# EAGLE design MXRDist+1590a (EAGLE 6.5.0)
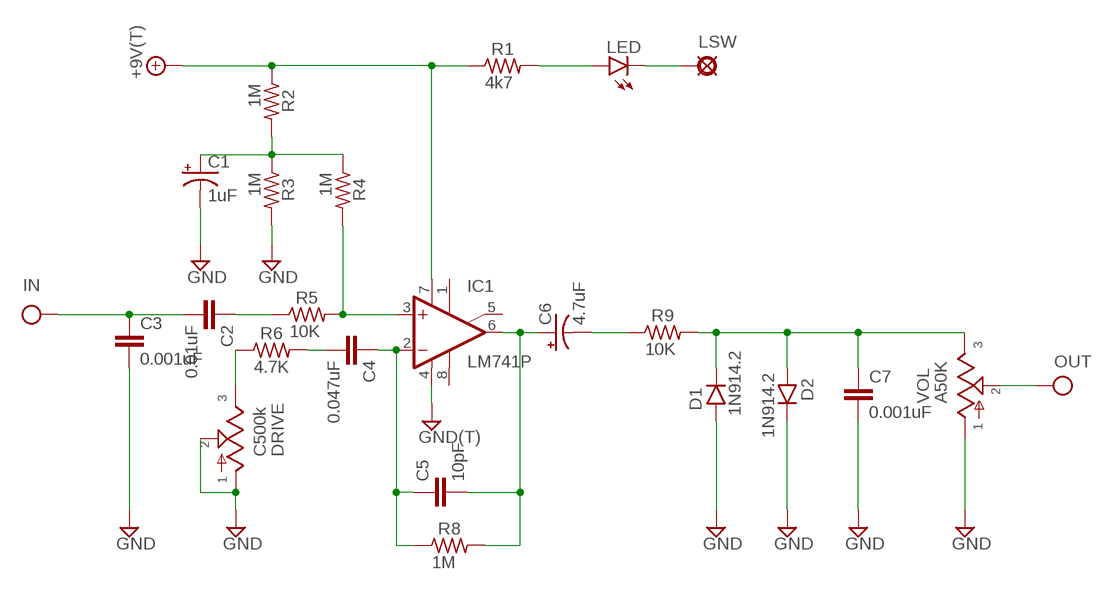
[diagram p0: schematic, sheet 1]

## Parts
+9V  +9V(T)  [SQUARE]
C1  1uF  044A1  [044A]
C2  0.01uF  070X0302  [070X030]
C3  0.001uF  070X0302  [070X030]
C4  0.047uF  070X0302  [070X030]
C5  10pF  050X030_0501  [050X030_050_1]
C6  4.7uF  044A1  [044A]
C7  0.001uF  070X0302  [070X030]
D1  1N914.2  [DO35-2]
D2  1N914.2  [DO35-2]
DRIVE  C500k  9MM  [POT_9MM_PACK]
GND  GND(T)  [SQUARE]
IC1  LM741P  [DIL08]
IN  IN(T)  [SQUARE]
LED  LED3MM  [LED3MM]
LSW  PAD  [SQUARE]
OUT  OUT(T)  [SQUARE]
R1  4k7  6MM.1  [R0207/1V]
R2  1M  6MM.1  [R0207/1V]
R3  1M  6MM.1  [R0207/1V]
R4  1M  6MM.1  [R0207/1V]
R5  10K  6MM.1  [R0207/1V]
R6  4.7K  6MM.1  [R0207/1V]
R8  1M  6MM.1  [R0207/1V]
R9  10K  6MM.1  [R0207/1V]
VOL  A50K  9MM  [POT_9MM_PACK]

## Nets
+9V: +9V.1(+9V) IC1.7(V+) R1.1 R2.1
GND: C1.2(-) C3.2 C7.2 D1.A D2.C DRIVE.P$1 DRIVE.P$2 GND.1(GND) IC1.4(V-) R3.2 VOL.P$1
IN: C2.2 C3.1 IN.1(IN)
N$1: C1.1(+) R2.2 R3.1 R4.1
N$2: IC1.3(+IN) R4.2 R5.2
N$3: C2.1 R5.1
N$4: DRIVE.P$3 R6.1
N$5: C5.2 C6.1(+) IC1.6(OUT) R8.2
N$6: C4.2 R6.2
N$7: C4.1 C5.1 IC1.2(-IN) R8.1
N$8: C6.2(-) R9.1
N$9: C7.1 D1.C D2.A R9.2 VOL.P$3
N$10: LED.A R1.2
N$11: LED.K(C) LSW.1(PAD)
OUT: OUT.1(OUT) VOL.P$2
Unconnected: IC1.1(ON1) IC1.5(ON2) IC1.8(OPT)

## Library data of the parts
+9V = mb_supply:+9V(T): +9V Voltage Supply use this to hook up +9v throughout a schematic instead of running wire automatically labels the net "+9v" adds a hookup pad to the circuit board
C1 C6 = mb_caps-tant:044A: .1 - 1.5µF Vishay Sprague Tantalex Long/Short (Case Code A); 4.4mm; 0.1" lead spacing 35 WVDC
C2-C4 C7 = mb_caps-chicklet:070X030: 0.0001 - .01uF (100 - 10,000pF) Panasonic ECQ-B 7mm x 3mm 50 or 63V: 0.0001 - .01uF (100 - 10,000pF);
C5 = mb_caps-ceramic:050X030_050: 120 - 150pF Xicon Ceramic Disc 5mm lead spacing
D1 D2 = mb_diodes:1N914: Fast Switching Diode DO-35 glass case a.k.a. 1N4148
DRIVE VOL = mb_9mm Pot:9MM
GND = mb_supply:GND(T): Ground use this to hook up ground (GND) throughout a schematic instead of running wire automatically labels the net "GND" adds a hookup pad to the circuit board (you can use several)
IC1 = mb_ics:*741: OP AMP
IN = mb_supply:IN(T): Input obsolete: use Pad instead and label net shematic input label with circuit board terminal/pad generally used only once on a schematic (because this device labels the net "IN" in the same way as a voltage supply or ground net)
LED = mb_diodes:LED
LSW = mb_supply:PAD: PAD use this package for pads with any purpose, including input, output, send or return various pad shapes: round, square, octogonal, long, and long offset
OUT = mb_supply:OUT(T): Output obsolete: use Pad instead and label net output label with circuit board terminal/pad usually appears only once on a schematic
R1-R6 R8 R9 = mb_resistors:6MM: 6mm Resistors Leads spaced 1-6 holes apart for 0.1" perfboard. Suitable for 1/4 watt resistors.

## Board
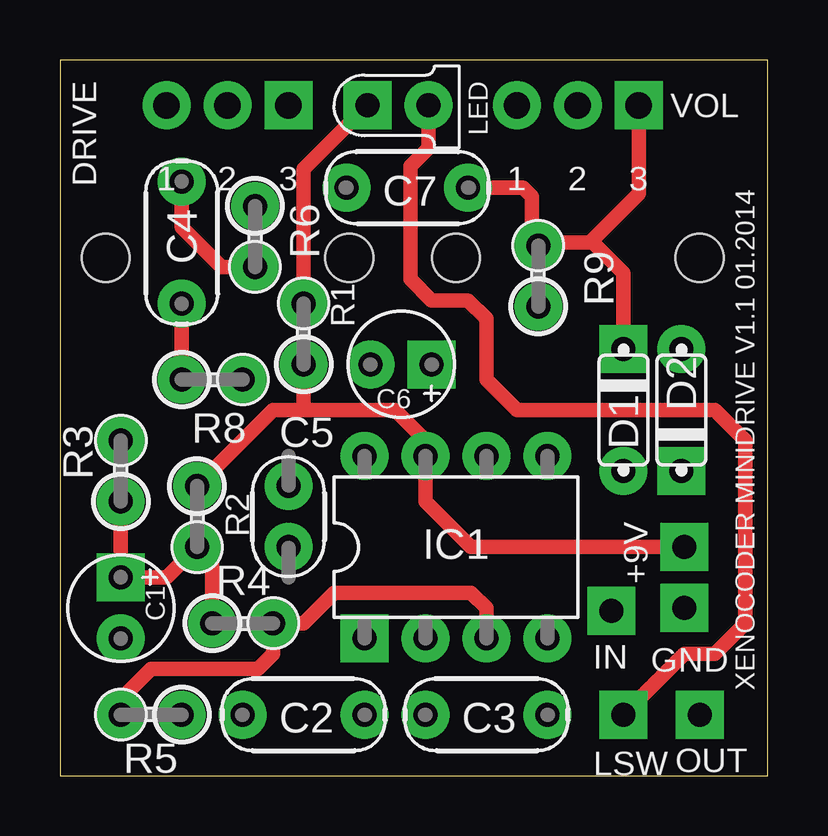
[diagram p1: board, top side]
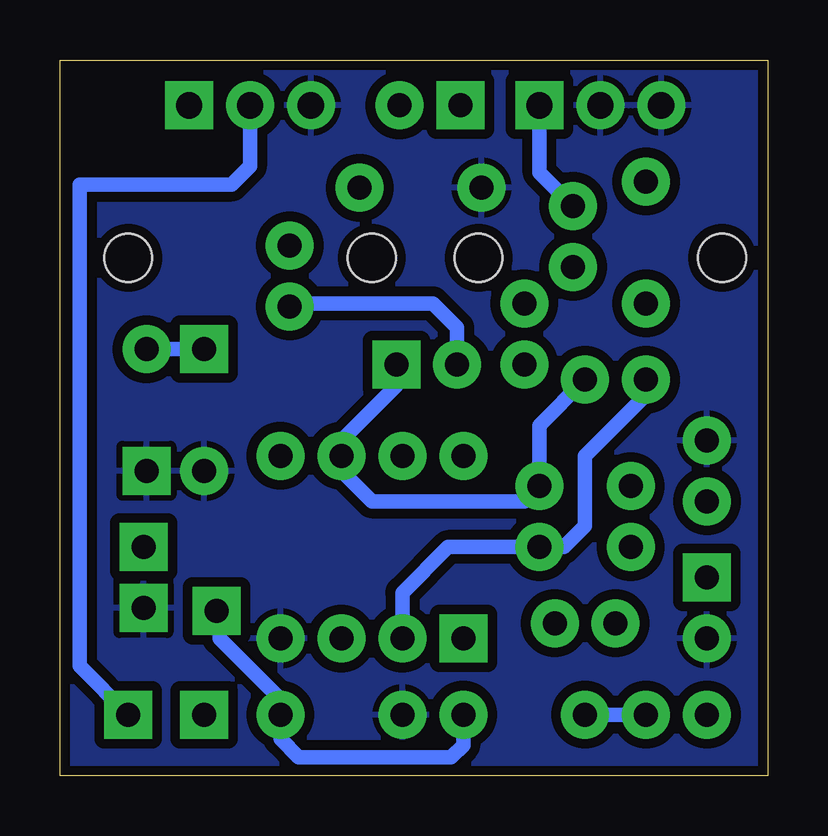
[diagram p2: board, bottom side, seen from below]

Size 29.52 x 29.84 mm. Coordinates in mm from the lower left corner, seen from the top.
Outline: 0,0 29.52,0 29.52,29.84 0,29.84 0,0
Copper layers (1*16): Top 0.0356mm / dielectric 1.5011mm / Bottom 0.0356mm
Design rules "LaenPCBOrder": minimum track width 6mil, minimum drill 13mil, track to track 6mil, track to pad 6mil, pad to pad 6mil, via to via 6mil, smd to smd 6mil, copper to edge 15mil, drill to drill 6mil, minimum pad ring 7mil, minimum via ring 7mil, stop-mask expansion 3mil, vias tented up to drill 0mil, thermal gap 10mil

### Footprints (pad centres in the part's own frame; a part is rotated, then mirrored left to right if it is on the bottom)
SQUARE = drill 1 pad 2 square: 1 0,0
044A = drill 1 pad 2 square: 1 -1.27,0 | drill 1 pad 2: 2 1.27,0
070X030 = drill 1 pad 2: 1 -2.54,0; 2 2.54,0
050X030_050_1 = drill 1 pad 2: 1 -1.27,0; 2 1.27,0
DO35-2 = drill 1 pad 2: A 2.54,0 | drill 1 pad 2 square: C -2.54,0
POT_9MM_PACK = drill 1.1 pad 2: P$1 2.54,0; P$2 0,0 | drill 1.1 pad 2 square: P$3 -2.54,0 | hole 2: -5.08,6.35; 5.08,6.35
DIL08 = drill 1 pad 2 square: 1 -3.81,-3.81 | drill 1 pad 2: 2 -1.27,-3.81; 3 1.27,-3.81; 4 3.81,-3.81; 5 3.81,3.81; 6 1.27,3.81; 7 -1.27,3.81; 8 -3.81,3.81
LED3MM = drill 1 pad 2 square: A -1.27,0 | drill 1 pad 2: K 1.27,0
R0207/1V = drill 1 pad 2: 1 -1.27,0; 2 1.27,0

### Placement (x,y rotation side)
+9V  26.04,9.53 0 top
C1  2.54,6.99 270 top
C2  10.16,2.54 0 top
C3  17.78,2.54 180 top
C4  5.08,22.23 90 top
C5  9.53,10.79 90 top
C6  14.22,17.14 180 top
C7  14.48,24.51 180 top
D1  23.5,15.24 270 top
D2  25.91,15.24 90 top
DRIVE  6.99,27.94 180 top
GND  26.04,6.99 0 top
IC1  16.51,9.53 0 top
IN  22.99,6.86 0 top
LED  14.1,27.94 0 top
LSW  23.5,2.54 0 top
OUT  26.67,2.54 0 top
R1  10.16,18.41 90 top
R2  5.71,10.79 270 top
R3  2.54,12.7 90 top
R4  7.62,6.35 0 top
R5  3.81,2.54 180 top
R6  8.13,22.48 270 top
R8  6.35,16.51 0 top
R9  19.94,20.83 90 top
VOL  21.59,27.94 180 top

### Tracks (layer width: path | path; a pad name or v marks a point on that pad's centre or on a via)
+9V
  Top 0.61: +9V.1 17.14,9.53 15.24,11.43 IC1.7 15.24,13.97 13.97,15.24 10.16,15.24 | 10.16,15.24 8.89,15.24 R2.1 | R1.1 10.16,15.24
  Bottom 0.61: IC1.7 15.24,13.97
GND
  pour Bottom (isolate 0.406): 0,29.84 29.59,29.84 29.59,0 0,0
IN
  Bottom 0.61: C2.2 12.7,1.27 13.21,0.76 19.56,0.76 20.32,1.52 C3.1 20.32,3.17 22.86,5.71 22.86,6.73 IN.1
N$1
  Top 0.61: R4.1 6.35,8.89 R2.2 4.45,8.26 C1.1 R3.1
N$2
  Top 0.61: 17.78,6.35 IC1.3 17.78,6.99 17.14,7.62 11.43,7.62 10.16,6.35 R4.2 8.89,5.08 8.26,4.45 3.81,4.45 2.54,3.17 R5.2
N$3
  Bottom 0.61: R5.1 C2.1
N$4
  Bottom 0.61: R6.1 9.53,25.15 DRIVE.P$3
N$5
  Bottom 0.61: R8.2 9.53,14.61 C5.2 10.16,11.43 16.51,11.43 17.78,12.7 IC1.6 17.78,13.97 15.49,16.26 C6.1
N$6
  Top 0.61: R6.2 6.73,21.21 5.08,22.86 C4.2
N$7
  Top 0.61: R8.1 C4.1
  Bottom 0.61: IC1.2 15.24,7.62 13.34,9.53 C5.1 8.51,9.53 7.62,10.41 7.62,13.34 5.08,15.88 R8.1
N$8
  Bottom 0.61: C6.2 12.95,18.67 13.97,19.68 19.81,19.68 R9.1
N$9
  Top 0.61: D1.C 23.5,20.95 22.23,22.23 22.1,22.23 | 22.1,22.23 20.07,22.23 R9.2 19.68,22.35 19.68,24.13 19.3,24.51 C7.1 | VOL.P$3 24.13,24.26 22.1,22.23
  Bottom 0.61: D2.A D1.C
N$10
  Top 0.61: R1.2 10.16,25.27 LED.A
N$11
  Top 0.61: LED.K 15.37,26.16 14.61,25.4 14.61,20.7 15.49,19.81 17.02,19.81 17.78,19.05 17.78,16.51 19.05,15.24 27.3,15.24 28.57,13.97 28.57,6.35 27.3,5.08 26.04,5.08 LSW.1
OUT
  Bottom 0.61: VOL.P$2 21.59,25.4 22.35,24.64 28.7,24.64 28.7,4.57 OUT.1

### Text on the board
tNames: XENOCODER MINIDRIVE V1.1 01.2014